# EAGLE design Stick IMUinator2368 (EAGLE 6.1)
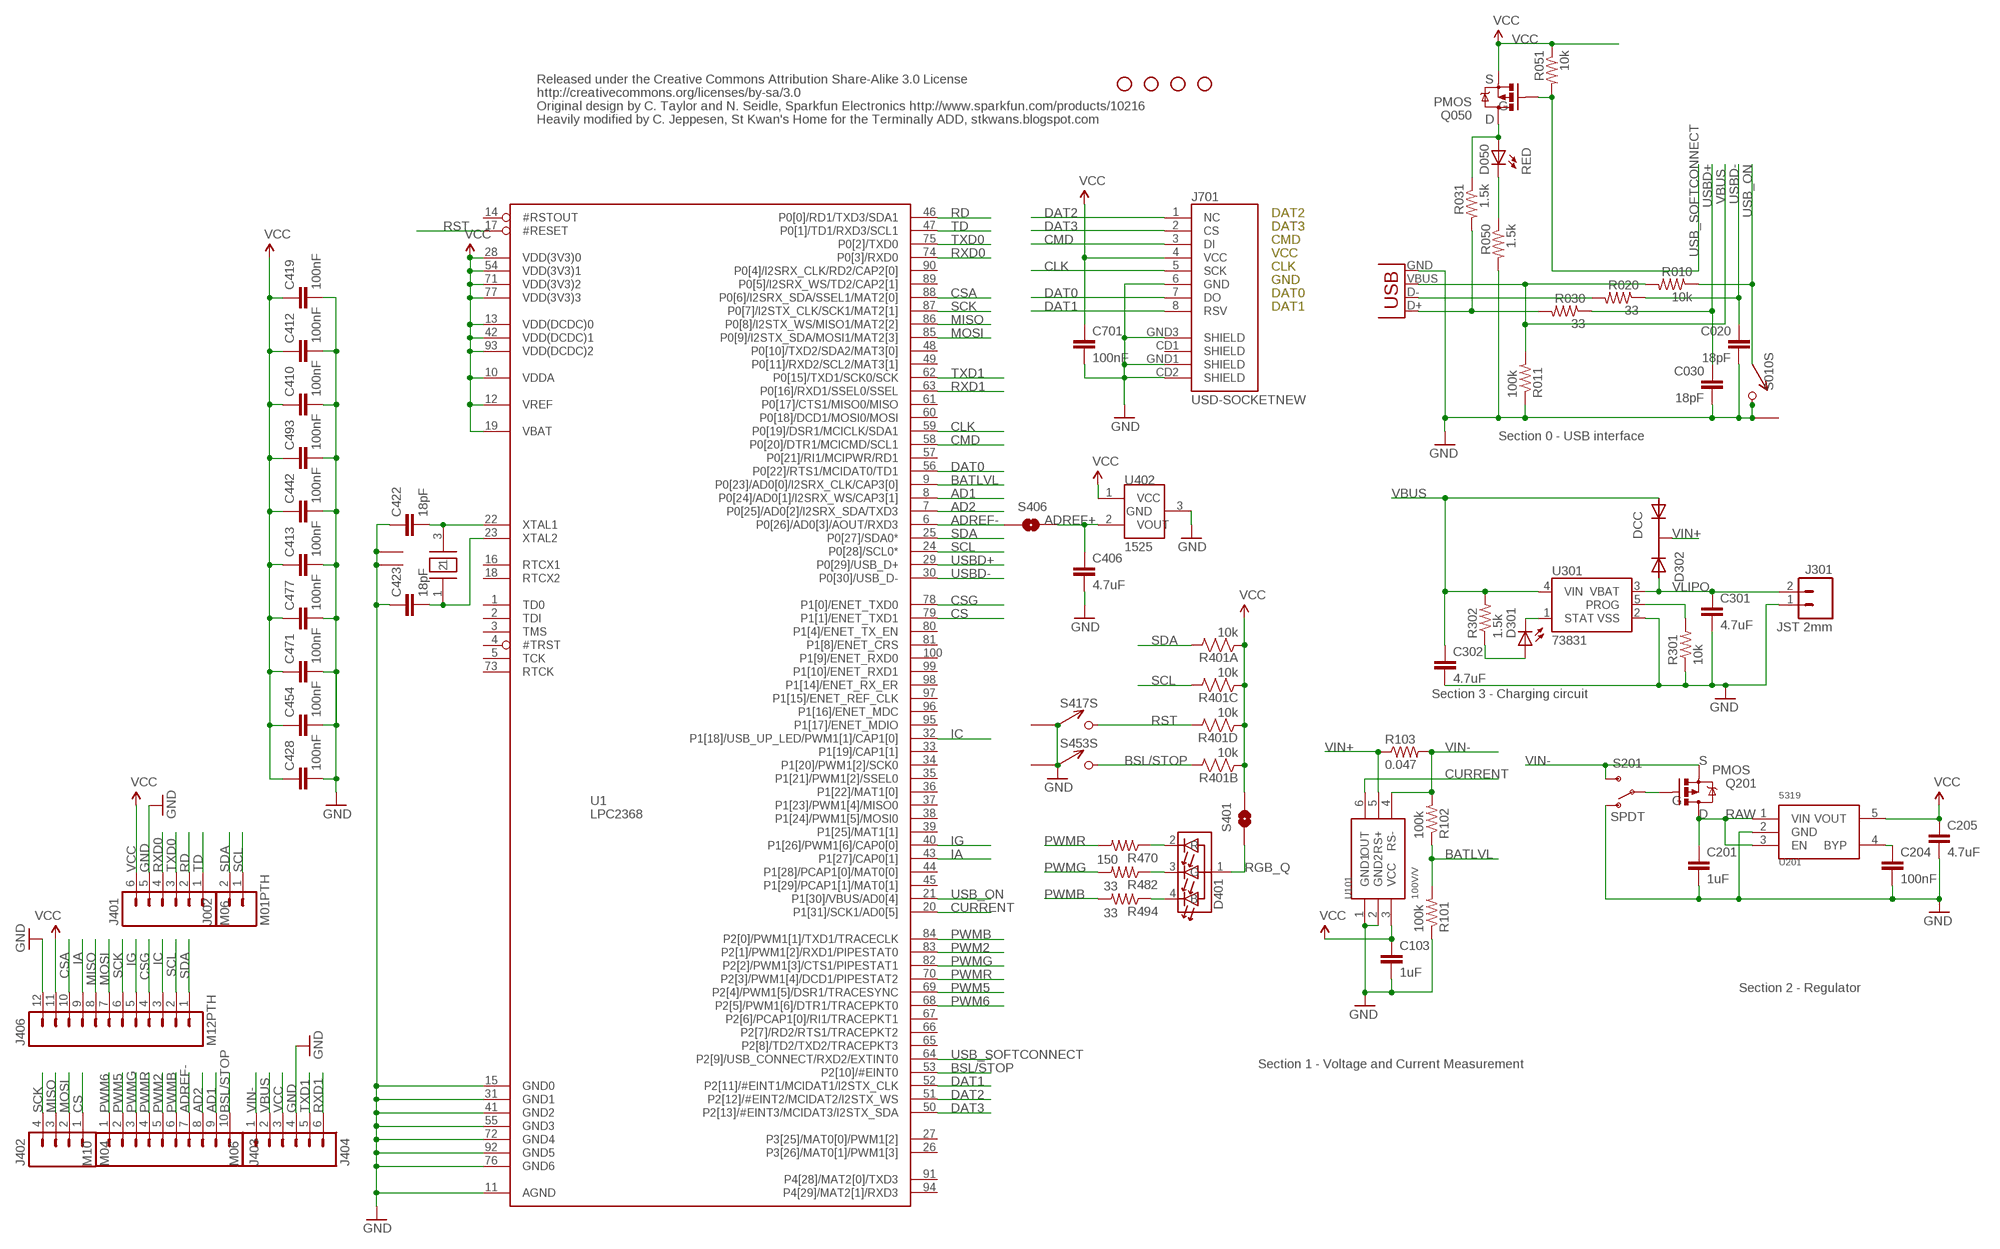
[diagram p0: schematic, sheet 1]

## Parts
C020  18pF  CAP0402-CAP  [0402-CAP]
C030  18pF  CAP0402-CAP  [0402-CAP]
C103  1uF  CAP0402-CAP  [0402-CAP]
C201  1uF  CAP0402-CAP  [0402-CAP]
C204  100nF  CAP0402-CAP  [0402-CAP]
C205  4.7uF  CAP0402-CAP  [0402-CAP]
C301  4.7uF  CAP0402-CAP  [0402-CAP]
C302  4.7uF  CAP0402-CAP  [0402-CAP]
C406  4.7uF  CAP0402-CAP  [0402-CAP]
C410  100nF  CAP0402-CAP  [0402-CAP]
C412  100nF  CAP0402-CAP  [0402-CAP]
C413  100nF  CAP0402-CAP  [0402-CAP]
C419  100nF  CAP0402-CAP  [0402-CAP]
C422  18pF  CAP0402-CAP  [0402-CAP]
C423  18pF  CAP0402-CAP  [0402-CAP]
C428  100nF  CAP0402-CAP  [0402-CAP]
C442  100nF  CAP0402-CAP  [0402-CAP]
C454  100nF  CAP0402-CAP  [0402-CAP]
C471  100nF  CAP0402-CAP  [0402-CAP]
C477  100nF  CAP0402-CAP  [0402-CAP]
C493  100nF  CAP0402-CAP  [0402-CAP]
C701  100nF  CAP0402-CAP  [0402-CAP]
D050  RED  LED0603  [LED-0603]
D301  RED  LED0603  [LED-0603]
D302  DCC  PMEG2005CT  [SOT-23-3]
D401  RGB  HSMF-C118  [HSMF-C118]
J001  USBSMD  [USB-MINIB]
J002  M01PTH  M02PTH  [1X02]
J301  JST 2mm  M02-JST-2MM-SMT  [JST-2-SMD]
J401  M06  M06SIP  [1X06]
J402  M04  M04PTH  [1X04]
J403  M10  M10"  [1X10]
J404  M06  M06SIP  [1X06]
J406  M12PTH  [1X12]
J701  USD-SOCKETNEW  [MICRO-SD-SOCKET-PP]
JP1  STAND-OFF  [STAND-OFF]
JP2  STAND-OFF  [STAND-OFF]
JP3  STAND-OFF  [STAND-OFF]
JP4  STAND-OFF  [STAND-OFF]
Q050  PMOS  MOSFET-PCHANNELSMD  [SOT23-3]
Q201  PMOS  MOSFET-PCHANNELSMD  [SOT23-3]
R010  10k  RESISTOR0402-RES  [0402-RES]
R011  100k  RESISTOR0402-RES  [0402-RES]
R020  33  RESISTOR0402-RES  [0402-RES]
R030  33  RESISTOR0402-RES  [0402-RES]
R031  1.5k  RESISTOR0402-RES  [0402-RES]
R050  1.5k  RESISTOR0402-RES  [0402-RES]
R051  10k  RESISTOR0402-RES  [0402-RES]
R101  100k  RESISTOR0402-RES  [0402-RES]
R102  100k  RESISTOR0402-RES  [0402-RES]
R103  0.047  RESISTOR0402-RES  [0402-RES]
R301  10k  RESISTOR0402-RES  [0402-RES]
R302  1.5k  RESISTOR0402-RES  [0402-RES]
R401  10k  RP404  [CRA04]
R470  150  RESISTOR0402-RES  [0402-RES]
R482  33  RESISTOR0402-RES  [0402-RES]
R494  33  RESISTOR0402-RES  [0402-RES]
S010  SPST  B3U-1100P  [B3U-1100P]
S201  SPDT  SWITCH-SPSTSMD  [AYZ0202]
S401  SOLDERJUMPERNO  [SJ_2S-NO]
S406  SOLDERJUMPERNO  [SJ_2S-NO]
S417  SPST  B3U-1100P  [B3U-1100P]
S453  SPST  B3U-1100P  [B3U-1100P]
U1  LPC2368  [LQFP100]
U101  100V/V  MAX4173  [SOT-23-6]
U201  5319  MIC5319D5  [SOT-23-5]
U301  73831  MCP73831  [SOT23-5]
U402  1525  MCP1525  [SOT-23-3]
Y401  12M  TSX-3225  [CRYSTAL_SMD]

## Nets
AD1: J403.9 U1.8(P0[24]/AD0[1]/I2SRX_WS/CAP3[1])
AD2: J403.8 U1.7(P0[25]/AD0[2]/I2SRX_SDA/TXD3)
ADREF+: C406.1 S406.1 U402.2(VOUT)
ADREF-: J403.7 S406.2 U1.6(P0[26]/AD0[3]/AOUT/RXD3)
BATLVL: R101.2 R102.1 U1.9(P0[23]/AD0[0]/I2SRX_CLK/CAP3[0])
BSL/STOP: J403.10 R401.7 S453.P$2 U1.53(P2[10]/#EINT0)
CLK: J701.5(SCK) U1.59(P0[19]/DSR1/MCICLK/SDA1)
CMD: J701.3(DI) U1.58(P0[20]/DTR1/MCICMD/SCL1)
CONN_D+: J001.D+ R030.2 R031.2
CONN_D-: J001.D- R020.2
CS: J402.1 U1.79(P1[1]/ENET_TXD1)
CSA: J406.10 U1.88(P0[6]/I2SRX_SDA/SSEL1/MAT2[0])
CSG: J406.4 U1.78(P1[0]/ENET_TXD0)
CURRENT: U1.20(P1[31]/SCK1/AD0[5]) U101.6(OUT)
DAT0: J701.7(DO) U1.56(P0[22]/RTS1/MCIDAT0/TD1)
DAT1: J701.8(RSV) U1.52(P2[11]/#EINT1/MCIDAT1/I2STX_CLK)
DAT2: J701.1(NC) U1.51(P2[12]/#EINT2/MCIDAT2/I2STX_WS)
DAT3: J701.2(CS) U1.50(P2[13]/#EINT3/MCIDAT3/I2STX_SDA)
DB: D401.4(B) R494.1
DG: D401.3(G) R482.1
DR: D401.2(R) R470.1
GND: C020.2 C030.2 C103.2 C201.2 C204.2 C205.2 C301.2 C302.2 C406.2 C410.2 C412.2 C413.2 C419.2 C422.1 C423.1 C428.2 C442.2 C454.2 C471.2 C477.2 C493.2 C701.2 J001.GND J301.1 J401.5 J404.4 J406.12 J701.6(GND) J701.CD2(SHIELD) J701.GND1(SHIELD) J701.GND3(SHIELD) R011.1 R050.2 R101.1 R301.1 S010.P$2 S010.P$3 S201.1(O) S417.P$1 S417.P$3 S453.P$1 S453.P$3 U1.11(AGND) U1.15(GND0) U1.31(GND1) U1.41(GND2) U1.55(GND3) U1.72(GND4) U1.76(GND6) U1.92(GND5) U101.1(GND1) U101.2(GND2) U201.2(GND) U301.2(VSS) U402.3(GND) Y401.2 Y401.4
IA: J406.9 U1.43(P1[27]/CAP0[1])
IC: J406.3 U1.32(P1[18]/USB_UP_LED/PWM1[1]/CAP1[0])
IG: J406.5 U1.40(P1[26]/PWM1[6]/CAP0[0])
MISO: J402.3 J406.8 U1.86(P0[8]/I2STX_WS/MISO1/MAT2[2])
MOSI: J402.2 J406.7 U1.85(P0[9]/I2STX_SDA/MOSI1/MAT2[3])
N$1: D301.A R302.1
N$2: R301.2 U301.5(PROG)
N$3: D301.C U301.1(STAT)
N$6: D050.A Q050.3(D) R031.1
N$7: D050.C R050.1
N$10: Q201.1(G) S201.2(P)
N$17: C204.1 U201.4(BYP)
PWM2: J403.5 U1.83(P2[1]/PWM1[2]/RXD1/PIPESTAT0)
PWM5: J403.2 U1.69(P2[4]/PWM1[5]/DSR1/TRACESYNC)
PWM6: J403.1 U1.68(P2[5]/PWM1[6]/DTR1/TRACEPKT0)
PWMB: J403.6 R494.2 U1.84(P2[0]/PWM1[1]/TXD1/TRACECLK)
PWMG: J403.3 R482.2 U1.82(P2[2]/PWM1[3]/CTS1/PIPESTAT1)
PWMR: J403.4 R470.2 U1.70(P2[3]/PWM1[4]/DCD1/PIPESTAT2)
RAW: C201.1 Q201.3(D) U201.1(VIN) U201.3(EN)
RD: J401.2 U1.46(P0[0]/RD1/TXD3/SDA1)
RGB_Q: D401.1(A) S401.1
RST: R401.5 S417.P$2 U1.17(#RESET)
RXD0: J401.4 U1.74(P0[3]/RXD0)
RXD1: J404.6 U1.63(P0[16]/RXD1/SSEL0/SSEL)
SCK: J402.4 J406.6 U1.87(P0[7]/I2STX_CLK/SCK1/MAT2[1])
SCL: J002.1 J406.2 R401.6 U1.24(P0[28]/SCL0*)
SDA: J002.2 J406.1 R401.8 U1.25(P0[27]/SDA0*)
TD: J401.1 U1.47(P0[1]/TD1/RXD3/SCL1)
TXD0: J401.3 U1.75(P0[2]/TXD0)
TXD1: J404.5 U1.62(P0[15]/TXD1/SCK0/SCK)
USB_ON: R010.1 S010.P$1 U1.21(P1[30]/VBUS/AD0[4])
USB_SOFTCONNECT: Q050.1(G) R051.2 U1.64(P2[9]/USB_CONNECT/RXD2/EXTINT0)
USBD+: C030.1 R030.1 U1.29(P0[29]/USB_D+)
USBD-: C020.1 R020.1 U1.30(P0[30]/USB_D-)
VBUS [power]: C302.1 D302.1(A1) J001.VBUS J404.2 R010.2 R011.2 R302.2 U301.4(VIN)
VCC: C103.1 C205.1 C410.1 C412.1 C413.1 C419.1 C428.1 C442.1 C454.1 C471.1 C477.1 C493.1 C701.1 J401.6 J404.3 J406.11 J701.4(VCC) Q050.2(S) R051.1 R401.1 R401.2 R401.3 R401.4 S401.2 U1.10(VDDA) U1.12(VREF) U1.13(VDD(DCDC)0) U1.19(VBAT) U1.28(VDD(3V3)0) U1.42(VDD(DCDC)1) U1.54(VDD(3V3)1) U1.71(VDD(3V3)2) U1.77(VDD(3V3)3) U1.93(VDD(DCDC)2) U101.3(VCC) U201.5(VOUT) U402.1(VCC)
VIN+: D302.3(K) R103.1 U101.5(RS+)
VIN-: J404.1 Q201.2(S) R102.2 R103.2 S201.3(S) U101.4(RS-)
VLIPO [power]: C301.1 D302.2(A2) J301.2 U301.3(VBAT)
XTAL1: C422.2 U1.22(XTAL1) Y401.3
XTAL2: C423.2 U1.23(XTAL2) Y401.1
Unconnected: J701.CD1(SHIELD) U1.1(TD0) U1.2(TDI) U1.3(TMS) U1.4(#TRST) U1.5(TCK) U1.14(#RSTOUT) U1.16(RTCX1) U1.18(RTCX2) U1.26(P3[26]/MAT0[1]/PWM1[3]) U1.27(P3[25]/MAT0[0]/PWM1[2]) U1.33(P1[19]/CAP1[1]) U1.34(P1[20]/PWM1[2]/SCK0) U1.35(P1[21]/PWM1[2]/SSEL0) U1.36(P1[22]/MAT1[0]) U1.37(P1[23]/PWM1[4]/MISO0) U1.38(P1[24]/PWM1[5]/MOSI0) U1.39(P1[25]/MAT1[1]) U1.44(P1[28]/PCAP1[0]/MAT0[0]) U1.45(P1[29]/PCAP1[1]/MAT0[1]) U1.48(P0[10]/TXD2/SDA2/MAT3[0]) U1.49(P0[11]/RXD2/SCL2/MAT3[1]) U1.57(P0[21]/RI1/MCIPWR/RD1) U1.60(P0[18]/DCD1/MOSI0/MOSI) U1.61(P0[17]/CTS1/MISO0/MISO) U1.65(P2[8]/TD2/TXD2/TRACEPKT3) U1.66(P2[7]/RD2/RTS1/TRACEPKT2) U1.67(P2[6]/PCAP1[0]/RI1/TRACEPKT1) U1.73(RTCK) U1.80(P1[4]/ENET_TX_EN) U1.81(P1[8]/ENET_CRS) U1.89(P0[5]/I2SRX_WS/TD2/CAP2[1]) U1.90(P0[4]/I2SRX_CLK/RD2/CAP2[0]) U1.91(P4[28]/MAT2[0]/TXD3) U1.94(P4[29]/MAT2[1]/RXD3) U1.95(P1[17]/ENET_MDIO) U1.96(P1[16]/ENET_MDC) U1.97(P1[15]/ENET_REF_CLK) U1.98(P1[14]/ENET_RX_ER) U1.99(P1[10]/ENET_RXD1) U1.100(P1[9]/ENET_RXD0)

## Notes on the sheet
- Released under the Creative Commons Attribution Share-Alike 3.0 License | S
- http://creativecommons.org/licenses/by-sa/3.0
- Original design by C. Taylor and N. Seidle, Sparkfun Electronics http://www.sparkfun.com/products/10216 | G
- Heavily modified by C. Jeppesen, St Kwan's Home for the Terminally ADD, stkwans.blogspot.com | D
- DAT2
- DAT3
- CMD
- VCC
- CLK
- GND
- DAT0
- DAT1
- Section 0 - USB interface
- Section 3 - Charging circuit
- S
- G
- D
- Section 2 - Regulator
- Section 1 - Voltage and Current Measurement

## Library data of the parts
C020 C030 C103 C201 C204 C205 C301 C302 C406 C410 C412 C413 C419 C422 C423 C428 C442 C454 C471 C477 C493 C701 = SparkFun:CAP: Capacitor Standard 0603 ceramic capacitor, and 0.1" leaded capacitor.
D050 D301 = SparkFun:LED: LEDs Standard schematic elements and footprints for 5mm, 3mm, 1206, and 0603 sized LEDs. 5mm - Spark Fun Electronics SKU : COM-00529 (and others)
D302 = KwanSystems:PMEG2005CT
D401 = KwanSystems:HSMF-C118
J001 = SparkFun:USB: USB Connectors USB-B-PTH is fully proven SKU : PRT-00139 USB-miniB is fully proven SKU : PRT-00587 USB-A-PCB is untested. USB-A-H is throughly reviewed, but untested. Spark Fun Electronics SKU : PRT-00437 USB-B-SMT is throughly reviewed, but untested. Needs silkscreen touching up. USB-A-S has not been used/tested USB-MB-H has not been used/tested
J002 J301 = SparkFun:M02: Header 2 Standard 2-pin 0.1" header. Use with straight break away headers (SKU : PRT-00116), right angle break away headers (PRT-00553), swiss pins (PRT-00743), machine pins (PRT-00117), and female headers (PRT-00115). Molex polarized connector foot print use with SKU : PRT-08233 with associated crimp pins and housings.
J401 J404 = SparkFun:M06: Header 6 Standard 6-pin 0.1" header. Use with straight break away headers (SKU : PRT-00116), right angle break away headers (PRT-00553), swiss pins (PRT-00743), machine pins (PRT-00117), and female headers (PRT-00115). Molex polarized connector foot print use with SKU : PRT-08094 with associated crimp pins and housings. NOTES ON THE VARIANTS LOCK and LOCK_LONGPADS... This footprint was designed to help hold the alignment of a through-hole component (i.e. 6-pin header) while soldering it into place. You may notice that each hole has been shifted either up or down by 0.005 of an inch from it's more standard position (which is a perfectly straight line). This slight alteration caused the pins (the squares in the middle) to touch the edges of the holes. Because they are alternating, it causes a "brace" to hold the component in place. 0.005 has proven to be the perfect amount of "off-center" position when using our standard breakaway headers. Although looks a little odd when you look at the bare footprint, once you have a header in there, the alteration is very hard to notice. Also, if you push a header all the way into place, it is covered up entirely on the bottom side. This idea of altering the position of holes to aid alignment will be further integrated into the Sparkfun Library for other footprints. It can help hold any component with 3 or more connection pins.
J402 = SparkFun:M04: Header 4 Standard 4-pin 0.1" header. Use with straight break away headers (SKU : PRT-00116), right angle break away headers (PRT-00553), swiss pins (PRT-00743), machine pins (PRT-00117), and female headers (PRT-00115). Molex polarized connector foot print use with SKU : PRT-08231 with associated crimp pins and housings. 1MM SMD Version SKU: PRT-10208
J403 = SparkFun:M10: Header 10 Standard 10-pin 0.1" header. Use with straight break away headers (SKU : PRT-00116), right angle break away headers (PRT-00553), swiss pins (PRT-00743), machine pins (PRT-00117), and female headers (PRT-00115).
J406 = SparkFun:M12: Header 12 Standard 12-pin 0.1" header. Use with straight break away headers (SKU : PRT-00116), right angle break away headers (PRT-00553), swiss pins (PRT-00743), machine pins (PRT-00117), and female headers (PRT-00115).
J701 = SparkFun:USD-SOCKET: microSD Socket Push-push type uSD socket. Schematic element and footprint production proven. Spark Fun Electronics SKU : PRT-00127. tDoc lines correctly indicate media card edge positions when inserting (unlocked, locked, depressed).
JP1-JP4 = SparkFun:STAND-OFF: Stand Off This is the mechanical footprint for a #4 phillips button head screw. Use the keepout ring to avoid running the screw head into surrounding components. SKU : PRT-00447
Q050 Q201 = SparkFun:MOSFET-PCHANNEL
R010 R011 R020 R030 R031 R050 R051 R101-R103 R301 R302 R470 R482 R494 = SparkFun:RESISTOR: Resistor Basic schematic elements and footprints for 0603, 1206, and PTH resistors.
R401 = KwanSystems:RP4
S010 S417 S453 = KwanSystems:B3U-1100P
S201 = SparkFun:SWITCH-SPST: SPST Switch Simple slide switch. Spark Fun Electronics SKU : COM-00102
S401 S406 = SparkFun:SOLDERJUMPER: Solder Jumper Standard SMD solder jumper. Used to automate production. Two varients : Normally Open and Normally Closed are the same, but have different paste layers. NC will have a large amount of paste and should jumper during reflow.
U1 = KwanSystems:LPC2368
U101 = KwanSystems:MAX4173
U201 = KwanSystems:MIC5319
U301 = SparkFun:MCP73831: Microchip's MCP73831 Miniature single cell, fully integrated Li-Ion, Li-polymer charge management controller http://ww1.microchip.com/downloads/en/DeviceDoc/21984a.pdf
U402 = KwanSystems:MCP1525
Y401 = KwanSystems:TSX-3225

## Net classes
0 default: width 0.152 mm, drill 0.33 mm, clearance 0.152 mm
1 power: width 0.152 mm, drill 0.33 mm, clearance 0.152 mm to class 0, clearance 0.152 mm
2 hv: width 0.152 mm, drill 0.33 mm, clearance 0.152 mm to class 0, clearance 0.152 mm to class 1, clearance 0.152 mm

## Board
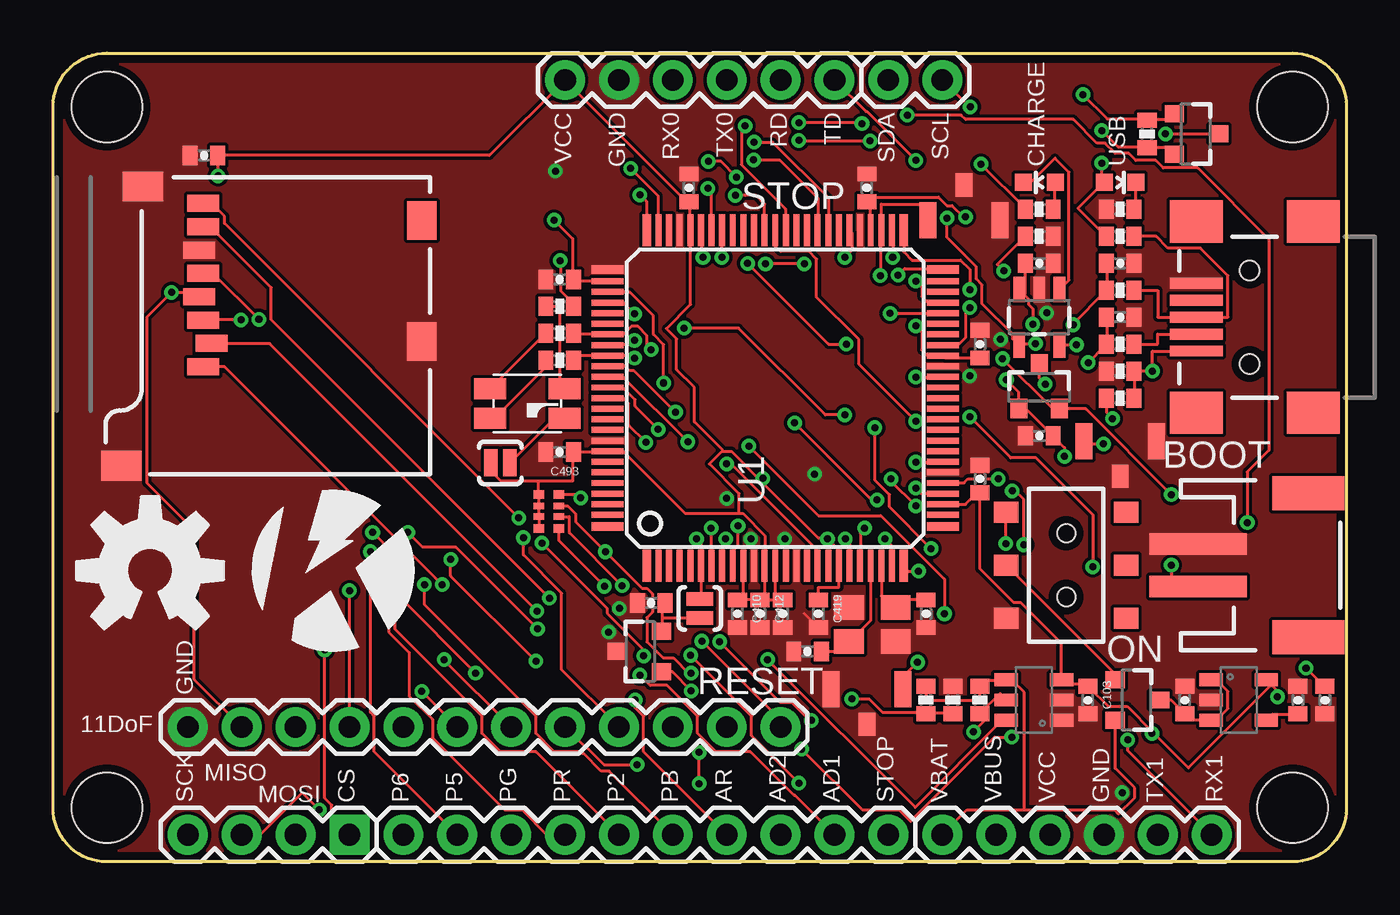
[diagram p1: board, top side]
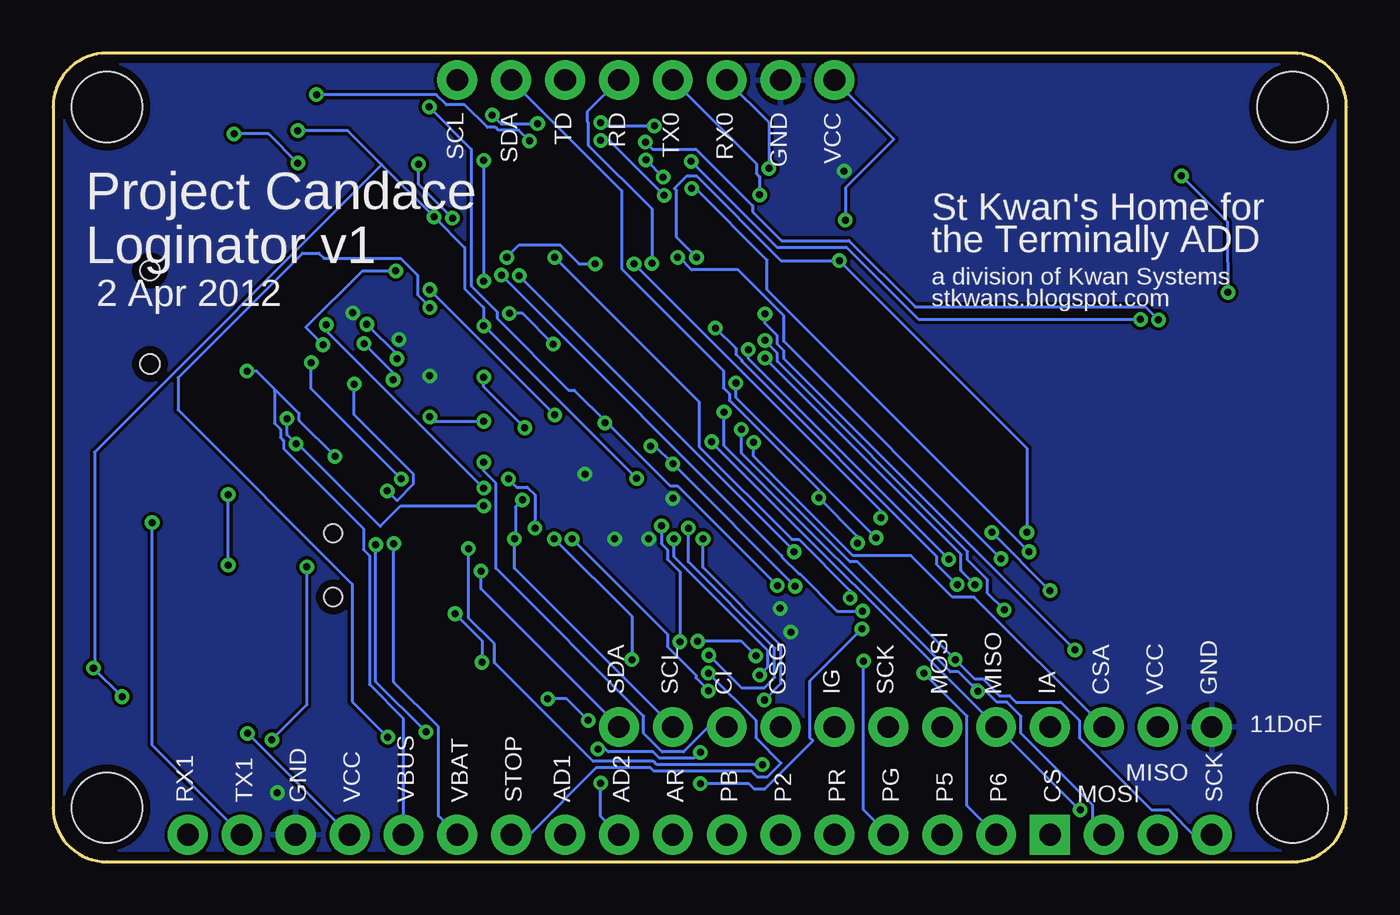
[diagram p2: board, bottom side, seen from below]

Size 60.96 x 38.1 mm. Coordinates in mm from the lower left corner, seen from the top.
Outline: 2.54,38.1 58.42,38.1 arc-90 60.96,35.56 60.96,2.54 arc-90 58.42,0 2.54,0 arc-90 0,2.54 0,35.56 arc-90 2.54,38.1
Copper layers (1*16): Top 0.0356mm / dielectric 1.5011mm / Bottom 0.0356mm
Design rules: minimum track width 6mil, minimum drill 13mil, track to track 6mil, track to pad 6mil, pad to pad 6mil, via to via 6mil, smd to smd 6mil, copper to edge 15mil, drill to drill 6mil, minimum pad ring 7mil, minimum via ring 7mil, stop-mask expansion 4mil, vias tented up to drill 14mil, thermal gap 10mil
vRestrict: area 5.8,2.3 to 6.6,5.1; area 7.1,3.8 to 10.4,4.6; area 9.4,2.8 to 13,3.6; area 13.2,2.8 to 14.5,4.8; area 15.7,2.8 to 17,4.8; area 18.3,2.8 to 19.6,4.8; area 20.8,2.8 to 22.1,4.8; area 23.4,2.8 to 24.6,4.8; area 25.9,2.8 to 27.2,4.8; area 28.4,2.8 to 29.7,4.8; area 31,2.8 to 32.3,4.8; area 33.5,2.8 to 34.8,4.8; 44 more areas

### Footprints (pad centres in the part's own frame; a part is rotated, then mirrored left to right if it is on the bottom)
0402-CAP = smd 0.7 x 0.9: 1 -0.65,0; 2 0.65,0
LED-0603 = smd 0.8 x 0.8: A 0,-0.75; C 0,0.75
SOT-23-3 = smd 0.9 x 0.8: 1 -1,0.95; 2 -1,-0.95; 3 1.1,0
HSMF-C118 = smd 1.5 x 1: 1 1.75,-0.7; 2 1.75,0.7; 3 -1.75,0.7; 4 -1.75,-0.7
USB-MINIB = smd 2.5 x 0.5: D+ 2.5,0; D- 2.5,0.8; GND 2.5,-1.6; ID 2.5,-0.8; VBUS 2.5,1.6 | smd 2.5 x 2: MTN1 -3,4.5; MTN2 2.5,4.5; MTN3 -3,-4.5; MTN4 2.5,-4.5 | hole 0.9: 0,2.2; 0,-2.2
1X02 = drill 1.016 pad 1.88: 1 0,0; 2 2.54,0
JST-2-SMD = smd 1 x 4.6: 1 -1,-3.7; 2 1,-3.7 | smd 1.6 x 3.4: NC1 -3.4,1.5; NC2 3.4,1.5
1X06 = drill 1.016 pad 1.88: 1 0,0; 2 2.54,0; 3 5.08,0; 4 7.62,0; 5 10.16,0; 6 12.7,0
1X04 = drill 1.016 pad 1.88 square: 1 0,0 | drill 1.016 pad 1.88: 2 2.54,0; 3 5.08,0; 4 7.62,0
1X10 = drill 1.016 pad 1.88: 1 0,0; 2 2.54,0; 3 5.08,0; 4 7.62,0; 5 10.16,0; 6 12.7,0; 7 15.24,0; 8 17.78,0; 9 20.32,0; 10 22.86,0
1X12 = drill 1.016 pad 1.88: 1 0,0; 2 2.54,0; 3 5.08,0; 4 7.62,0; 5 10.16,0; 6 12.7,0; 7 15.24,0; 8 17.78,0; 9 20.32,0; 10 22.86,0; 11 25.4,0; 12 27.94,0
MICRO-SD-SOCKET-PP = smd 0.8 x 1.5: 1 -8.94,10.7; 2 -7.84,10.3; 3 -6.74,10.7; 4 -5.64,10.9; 5 -4.54,10.7; 6 -3.44,10.9; 7 -2.34,10.7; 8 -1.24,10.7 | smd 1.8 x 1.4: CD1 -2.05,0.4; CD2 -7.75,0.4 | smd 1.4 x 1.9: GND1 -13.6,14.55; GND3 -0.45,13.55
STAND-OFF = hole 3.302: 0,0
SOT23-3 = smd 0.8 x 0.9: 1 -0.95,-1; 2 0.95,-1; 3 0,1.1
0402-RES = smd 0.7 x 0.9: 1 -0.65,0; 2 0.65,0
CRA04 = smd 0.4 x 0.5: 1 -0.8,-0.475; 4 0.8,-0.475; 5 0.8,0.475; 8 -0.8,0.475 | smd 0.3 x 0.5: 2 -0.25,-0.475; 3 0.25,-0.475; 6 0.25,0.475; 7 -0.25,0.475
B3U-1100P = smd 0.8 x 1.7: P$1 -1.7,0; P$2 1.7,0 | smd 0.8 x 1.1: P$3 0,-1.65
AYZ0202 = smd 1 x 1.15: 1 -2.5,2.825; 2 0,2.825; 3 2.5,2.825; 4 -2.5,-2.825; 5 0,-2.825; 6 2.5,-2.825 | hole 0.85: 1.5,0; -1.5,0
SJ_2S-NO = smd 0.635 x 1.27: 1 -0.45,0; 2 0.45,0
LQFP100 = smd 1.5 x 0.4: 1 -7.9,6.06; 25 -7.9,-6.06; 51 7.9,-6.06; 75 7.9,6.06 | smd 1.5 x 0.28: 2 -7.9,5.5; 3 -7.9,5; 4 -7.9,4.5; 5 -7.9,4; 6 -7.9,3.5; 7 -7.9,3; 8 -7.9,2.5; 9 -7.9,2; 10 -7.9,1.5; 11 -7.9,1; 12 -7.9,0.5; 13 -7.9,0; 14 -7.9,-0.5; 15 -7.9,-1; 16 -7.9,-1.5; 17 -7.9,-2; 18 -7.9,-2.5; 19 -7.9,-3; 20 -7.9,-3.5; 21 -7.9,-4; 22 -7.9,-4.5; 23 -7.9,-5; 24 -7.9,-5.5; 52 7.9,-5.5; 53 7.9,-5; 54 7.9,-4.5; 55 7.9,-4; 56 7.9,-3.5; 57 7.9,-3; 58 7.9,-2.5; 59 7.9,-2; 60 7.9,-1.5; 61 7.9,-1; 62 7.9,-0.5; 63 7.9,0; 64 7.9,0.5; 65 7.9,1; 66 7.9,1.5; 67 7.9,2; 68 7.9,2.5; 69 7.9,3; 70 7.9,3.5; 71 7.9,4; 72 7.9,4.5; 73 7.9,5; 74 7.9,5.5 | smd 0.4 x 1.5: 26 -6.06,-7.9; 50 6.06,-7.9; 76 6.06,7.9; 100 -6.06,7.9 | smd 0.28 x 1.5: 27 -5.5,-7.9; 28 -5,-7.9; 29 -4.5,-7.9; 30 -4,-7.9; 31 -3.5,-7.9; 32 -3,-7.9; 33 -2.5,-7.9; 34 -2,-7.9; 35 -1.5,-7.9; 36 -1,-7.9; 37 -0.5,-7.9; 38 0,-7.9; 39 0.5,-7.9; 40 1,-7.9; 41 1.5,-7.9; 42 2,-7.9; 43 2.5,-7.9; 44 3,-7.9; 45 3.5,-7.9; 46 4,-7.9; 47 4.5,-7.9; 48 5,-7.9; 49 5.5,-7.9; 77 5.5,7.9; 78 5,7.9; 79 4.5,7.9; 80 4,7.9; 81 3.5,7.9; 82 3,7.9; 83 2.5,7.9; 84 2,7.9; 85 1.5,7.9; 86 1,7.9; 87 0.5,7.9; 88 0,7.9; 89 -0.5,7.9; 90 -1,7.9; 91 -1.5,7.9; 92 -2,7.9; 93 -2.5,7.9; 94 -3,7.9; 95 -3.5,7.9; 96 -4,7.9; 97 -4.5,7.9; 98 -5,7.9; 99 -5.5,7.9
SOT-23-6 = smd 0.6 x 1.1: 1 -0.95,-1.3; 2 0,-1.3; 3 0.95,-1.3; 4 0.95,1.3; 5 0,1.3; 6 -0.95,1.3
SOT-23-5 = smd 0.6 x 1.1: 1 -0.95,-1.3; 2 0,-1.3; 3 0.95,-1.3; 4 0.95,1.3; 5 -0.95,1.3
SOT23-5 = smd 0.55 x 1.2: 1 -0.95,-1.3; 2 0,-1.3; 3 0.95,-1.3; 4 0.95,1.3; 5 -0.95,1.3
CRYSTAL_SMD = smd 1.4 x 1.15: 1 -1.1,-0.8; 2 1.1,-0.8; 3 1.1,0.8; 4 -1.1,0.8

### Placement (x,y rotation side)
C020  50.29,25.65 0 top
C030  50.29,28.19 0 top
C103  48.77,7.62 270 top
C201  53.34,7.62 90 top
C204  58.67,7.62 90 top
C205  59.94,7.62 270 top
C301  46.48,28.19 0 top
C302  46.48,20.07 180 top
C406  28.19,12.19 180 top
C410  32.26,11.68 270 top
C412  33.32,11.68 270 top
C413  34.39,11.68 270 top
C419  36.07,11.68 270 top
C422  35.56,9.91 0 top
C423  41.15,11.68 90 top
C428  43.69,18.03 90 top
C442  43.69,24.38 90 top
C454  38.35,31.75 90 top
C471  29.97,31.75 90 top
C477  23.88,27.43 180 top
C493  23.88,19.3 180 top
C701  7.11,33.27 180 top
D050  50.29,32 270 top
D301  46.48,32 90 top
D302  46.48,22.35 90 top
D401  22.35,21.59 0 top
J001  56.39,25.65 180 top
J002  41.91,36.83 180 top
J301  57.66,13.97 270 top
J401  36.83,36.83 180 top
J402  13.97,1.27 180 top
J403  16.51,1.27 0 top
J404  41.91,1.27 0 top
J406  34.29,6.35 180 top
J701  17.78,32.26 90 top
JP1  2.54,2.54 0 top
JP2  58.42,2.54 0 top
JP3  2.54,35.56 0 top
JP4  58.42,35.56 0 top
Q050  53.85,34.29 270 top
Q201  51.05,7.62 270 top
R010  50.29,21.84 0 top
R011  50.29,23.11 0 top
R020  50.29,24.38 0 top
R030  50.29,26.92 0 top
R031  50.29,29.46 0 top
R050  50.29,30.73 180 top
R051  51.56,34.29 90 top
R101  42.42,7.62 270 top
R102  41.15,7.62 90 top
R103  43.69,7.62 90 top
R301  46.48,29.46 180 top
R302  46.48,30.73 180 top
R401  23.37,16.51 270 top
R470  23.88,26.16 0 top
R482  23.88,24.89 0 top
R494  23.88,23.62 0 top
S010  50.29,19.81 0 top
S201  47.75,13.97 90 top
S401  21.08,18.8 180 top
S406  30.48,11.94 90 top
S417  38.35,8.13 0 top
S453  42.93,30.23 180 top
U1  34.04,21.84 90 top
U101  46.23,7.62 90 top
U201  55.88,7.62 270 top
U301  46.48,25.65 180 top
U402  27.69,9.91 180 top
U$1  [KWAN_CIRCLE]  13.21,13.72 0 top
U$2  [OSHW-LOGO-L]  4.57,13.72 0 top
Y401  38.61,11.18 180 top

### Tracks (layer width: path | path; a pad name or v marks a point on that pad's centre or on a via)
AD1  (via drill 0.33)
  Top 0.152: v31.7,15.21 31.55,15.06 U1.8 | v27.66,8.79 28.14,8.31 28.93,8.31 30.38,6.86 30.38,6.04 31.24,5.18 32.87,5.18 34.92,3.12 34.98,3.12 J403.9
  Bottom 0.152: v31.7,15.21 31.7,14.38 27.25,9.93 27.25,9.2 v27.66,8.79
AD2  (via drill 0.33)
  Top 0.152: v31.01,15.72 31.01,13.95 U1.7 | v30.05,9.73 32.92,6.86 32.92,5.94 v35.15,3.71
  Bottom 0.152: v31.01,15.72 31.01,14.12 26.95,10.06 26.95,8.69 27.43,8.2 28.52,8.2 v30.05,9.73 | v35.15,3.71 35.15,2.13 J403.8
ADREF+
  Top 0.152: 28.7,11.51 28.7,12.06 C406.1 | 28.7,11.51 28.7,10.87 U402.2 | 28.7,11.51 30.73,11.51 S406.1
ADREF-  (via drill 0.33)
  Top 0.152: 30.56,13.92 U1.6 | v30.33,15.21 30.53,15.01 30.53,14.02 U1.6 | v27.43,7.62 27.43,7.26 27.84,6.86 27.84,5.18 J403.7 | U1.6 30.54,12.59 S406.2
  Bottom 0.152: v30.33,15.21 30.33,13.87 26.64,10.19 26.64,8.41 v27.43,7.62
BATLVL  (via drill 0.33)
  Top 0.152: R101.2 42.42,6.99 41.15,6.99 R102.1 41.1,7.04 39.09,7.04 38.46,7.67 v37.64,7.67 | v35.74,6.66 35.66,6.66 34.8,7.52 34.27,7.52 v31.42,10.36 | v32.28,15.82 32.28,14.91 32.04,14.66 U1.9
  Bottom 0.152: v37.64,7.67 36.75,7.67 v35.74,6.66 | v31.42,10.36 31.42,13.66 32,14.25 32,14.71 32.28,14.99 v32.28,15.82
BSL/STOP  (via drill 0.33)
  Top 0.152: v38.99,27.61 38.99,29.72 39.01,29.74 U1.53 39.04,30.99 41.15,30.99 41.15,30.23 | R401.7 23.85,16.74 24.28,16.74 24.64,16.38 24.64,16 v26.04,14.61 27.76,12.88 27.99,12.88 28.25,12.62 28.25,11.76 27.99,11.51 27.99,10.36 28.75,9.6 29.23,9.6 29.95,8.89 v30.07,8.89 | 41.15,30.23 S453.P$2 | 41.15,30.23 40.89,30.23
  Bottom 0.152: v26.04,14.61 26.04,14.66 v38.99,27.61 | J403.10 38.51,1.27 35.36,4.42 32.79,4.42 32.64,4.27 28.04,4.27 27.76,3.99 27.3,3.99 26.64,4.65 27.84,5.84 27.84,6.66 v30.07,8.89
CLK  (via drill 0.33)
  Top 0.152: v9.7,25.55 7.54,27.71 J701.5 | v30.89,32.99 31.47,32.99 v32.21,32.26 | v33.02,33.07 34.24,33.07 36.04,31.27 36.04,29.77 36.07,29.74 | 36.07,29.72 36.07,29.74 | 36.07,29.74 U1.59
  Bottom 0.152: v9.7,25.55 20.17,25.55 23.57,28.96 26.85,28.96 v30.89,32.99 | v33.02,33.07 v32.21,32.26
CMD  (via drill 0.33)
  Top 0.152: v8.87,25.53 J701.3 | 36.52,29.77 U1.58 36.54,31.28 33.91,33.91 v33.05,33.91
  Bottom 0.152: v8.87,25.53 9.47,26.14 20.32,26.14 23.44,29.26 26.62,29.26 27.99,30.63 27.99,30.91 30.66,33.58 32.72,33.58 v33.05,33.91
CONN_D+
  Top 0.152: 53.87,25.65 J001.D+ | R031.2 51.99,29.46 52.55,28.91 54.08,28.91 55.37,27.61 55.37,25.65 J001.D+ | R030.2 52.07,26.92 52.07,25.65 J001.D+
CONN_D-
  Top 0.152: 53.87,24.87 J001.D- 52.07,24.85 52.07,24.38 R020.2
CS  (via drill 0.33)
  Top 0.152: v27.41,25.81 26.87,26.34 U1.79 | v12.8,9.98 12.8,3 13.13,2.67 13.13,2.11 J402.1
  Bottom 0.152: v27.41,25.81 27.41,25.38 26.82,24.79 26.82,24.38 26.52,24.08 26.52,23.7 v12.8,9.98
CSA  (via drill 0.33)
  Top 0.152: U1.88 26.87,21.84 27.13,21.59 27.13,20.57 v27.94,19.76
  Bottom 0.152: v27.94,19.76 27.94,19.1 23.27,14.43 20.52,14.43 18.57,12.47 17.55,12.47 J406.10
CSG  (via drill 0.33)
  Top 0.152: v28.78,22.55 28.78,24.36 28.3,24.84 28.3,25.73 27.2,26.82 26.14,26.82 U1.78 | v22.17,15.27 22.17,14.45 23.98,12.65 23.98,9.04 J406.4
  Bottom 0.152: v28.78,22.55 28.78,21.87 v22.17,15.27
CURRENT  (via drill 0.33)
  Top 0.152: v33.68,9.53 40.64,2.56 44.73,6.66 44.91,6.66 U101.6 | 37.52,13.95 U1.20 37.54,15.01 v37.34,15.21
  Bottom 0.152: v33.68,9.53 33.68,11.56 v37.34,15.21
DAT0  (via drill 0.33)
  Top 0.152: v23.39,12.42 10.29,25.53 10.29,27.05 7.37,29.97 7.11,29.97 7.08,29.94 J701.7 7.09,29.9 | v37.31,28.47 37.69,28.85 37.64,28.91 37.64,29.64 U1.56
  Bottom 0.152: v23.39,12.42 23.39,12.78 25.81,15.19 26.14,15.19 30.5,19.56 30.5,21.67 v37.31,28.47
DAT1  (via drill 0.33)
  Top 0.152: v21.95,16.2 8.08,30.07 8.08,30.4 7.47,31.01 J701.8 | v35.41,28.17 v33.58,28.17 | v39.57,28.47 39.57,29.72 U1.52
  Bottom 0.152: v21.95,16.2 21.95,16.54 v33.58,28.17 | v35.41,28.17 36.17,28.17 37.06,29.06 38.99,29.06 v39.57,28.47
DAT2  (via drill 0.33)
  Top 0.152: v18.34,13.06 8.08,23.32 J701.1 | v29.74,25.15 32.31,25.15 36.4,21.06 v37.31,21.06 | v43.2,26.95 43.2,27.91 42.77,28.35 40.49,28.35 40.1,28.74 U1.51
  Bottom 0.152: v18.34,13.06 18.36,13.06 19.33,14.02 19.33,14.4 28.5,23.57 28.5,23.62 28.78,23.9 28.78,24.18 v29.74,25.15 | v43.2,26.95 v37.31,21.06
DAT3  (via drill 0.33)
  Top 0.152: v22.81,11.81 10.21,24.41 7.49,24.41 J701.2 | 41.94,27.91 U1.50 41.91,27.93 41.91,27.94 40.13,27.94 v39.83,27.64
  Bottom 0.152: v22.81,11.81 24,11.81 25.76,13.56 25.81,13.56 26.62,14.38 26.62,14.43 v39.83,27.64
DB
  Top 0.152: R494.1 23.22,23.62 23.22,23.29 20.73,20.8 20.62,20.9 D401.4
DG
  Top 0.152: R482.1 23.22,24.89 20.62,22.3 D401.3
DR
  Top 0.152: 24.08,22.3 D401.2 24.1,22.32 24.13,22.35 23.88,22.35 23.88,26.16 R470.1
GND  (via drill 0.33)
  Top 0.152: 35.41,11.69 C419.2
  other vias: 44.65,24.61 43.21,22.89 46.84,25.86 50.39,3.25 26.19,10.82 26.7,11.94 32.89,15.21 31.75,17.12 23.67,32.54 34.49,15.21 35.89,18.26
  pour Bottom: 2.54,38.1 58.42,38.1 arc-90 60.96,35.56 60.96,2.54 arc-90 58.42,0 2.54,0 arc-90 0,2.54 0,35.56 arc-90
  pour Top (no thermals): 2.54,38.1 58.42,38.1 arc-90 60.96,35.56 60.96,2.54 arc-90 58.42,0 2.54,0 arc-90 0,2.54 0,35.56 arc-90
IA  (via drill 0.33)
  Top 0.152: v43.2,26.11 43,25.91 43,24.69 42.67,24.36 41.96,24.36 U1.43 | v45.19,5.87 44.37,5.87 40.41,1.91 39.88,2.44 38.15,2.44 v35.28,5.31 | v30.45,3.68 v30.45,5.16 | v22.84,10.97 18.97,14.83 17.4,14.83 v16.71,15.52 | J406.9 v13.97,12.78
  Bottom 0.152: v43.2,26.11 43.2,26.14 43.79,26.72 43.79,27.64 44.58,28.42 48.18,28.42 48.44,28.68 49.2,28.68 55.07,22.81 55.07,21.29 46.86,13.08 46.86,7.54 v45.19,5.87 | v35.28,5.31 34.92,5.31 34.8,5.18 32.69,5.18 32.38,4.88 30.73,4.88 v30.45,5.16 | v30.45,3.68 28.17,3.68 27.89,3.4 27.43,3.4 25.15,5.69 25.3,5.84 25.3,8.51 v22.84,10.97 | v13.97,12.78 v16.71,15.52
IC  (via drill 0.33)
  Top 0.152: v40.66,18.82 41.94,18.82 U1.32
  Bottom 0.152: v40.66,18.82 40.66,18.41 40.08,17.83 40.08,13.82 33.12,6.86 33.12,6.04 32.26,5.18 31.24,5.18 29.64,6.78 J406.3
IG  (via drill 0.33)
  Top 0.152: v40.66,22.84 U1.40 | v38.73,20.45 38.73,17.98 39.42,17.3 39.42,16.71 v41.38,14.76 | v27.53,4.57 25.96,4.57 25.12,5.41 25.07,5.41 J406.5
  Bottom 0.152: v40.66,22.84 40.66,22.38 v38.73,20.45 | v41.38,14.76 41.38,11.48 40.16,10.26 40.16,9.37 35.51,4.72 32.66,4.72 32.51,4.57 v27.53,4.57
MISO  (via drill 0.33)
  Top 0.152: v29.92,19.79 26.87,22.84 U1.86 | J402.3 9.75,1.27 11.73,3.25 v12.55,2.44
  Bottom 0.152: v29.92,19.79 29.92,19.76 J406.8 12.6,2.44 v12.55,2.44
MOSI  (via drill 0.33)
  Top 0.152: v29.34,21.18 27.38,23.14 27.18,23.14 26.98,23.34 U1.85 | v17.37,8.03 J406.7
  Bottom 0.152: v29.34,21.18 29.34,19.61 18.67,8.94 18.29,8.94 17.65,8.31 17.27,8.31 17.18,8.22 | 17.18,8.22 16.48,7.52 16,7.52 15.34,6.86 15.34,6.04 11.96,2.67 11.96,1.8 J402.2 | 17.18,8.22 v17.37,8.03
N$1
  Top 0.152: D301.A 47.22,30.81 47.14,30.73 R302.1
N$2  (via drill 0.33)
  Top 0.152: v44.81,27.84 44.5,28.14 R301.2 | v48.23,24.36 47.45,24.36 U301.5
  Bottom 0.152: v44.81,27.84 46.38,27.84 49.05,25.17 v48.23,24.36
N$3
  Top 0.152: D301.C 46.08,32 47.22,33.15 47.88,32.49 47.88,27.41 47.45,26.98 U301.1
N$6  (via drill 0.33)
  Top 0.152: R031.1 48.31,30.79 D050.A 49.48,32.05 49.43,32.11 v49.43,32.92 | v52.43,34.29 Q050.3
  Bottom 0.152: v52.43,34.29 50.8,34.29 v49.43,32.92
N$7
  Top 0.152: D050.C 51.03,30.81 50.95,30.73 R050.1
N$10
  Top 0.152: Q201.1 50.04,8.59 50.04,8.87 S201.2
N$17
  Top 0.152: C204.1 57.48,6.96 57.2,6.68 U201.4
PWM2  (via drill 0.33)
  Top 0.152: v27.41,24.56 27.2,24.36 26.14,24.36 U1.83 | v16.13,11.86 16.13,10.95 20.22,6.86 20.22,6.04 21.08,5.18 22.76,5.18 J403.5
  Bottom 0.152: v27.41,24.56 27.41,24.54 26.82,23.95 26.82,23.57 17.86,14.61 17.86,14.22 16.92,13.28 16.92,12.65 v16.13,11.86
PWM5  (via drill 0.33)
  Top 0.152: v30.86,31.73 31.01,31.57 31.01,29.77 U1.69 | v14.96,14.61 14.96,7.04 15.14,6.86 15.14,5.18 J403.2
  Bottom 0.152: v30.86,31.73 30.68,31.73 27.3,28.35 27.3,26.95 v14.96,14.61
PWM6  (via drill 0.33)
  Top 0.152: v31.52,28.47 31.52,29.74 U1.68 | v16.28,14.28 16.28,12.52 v19.91,8.89
  Bottom 0.152: v31.52,28.47 31.45,28.47 30.86,27.89 28.68,27.89 26.52,25.73 26.52,24.51 v16.28,14.28 | v19.91,8.89 17.88,6.86 17.88,2.64 J403.1
PWMB  (via drill 0.33)
  Top 0.152: v27.41,23.72 27.28,23.85 26.21,23.85 U1.84 26.11,23.85 24.74,23.85 24.51,23.62 24.54,23.6 R494.2 | v17.5,13.06 17.5,12.12 22.76,6.86 22.76,6.04 23.62,5.18 24.87,5.18 24.94,5.11 24.99,5.11 25.83,4.27 26.21,4.27 J403.6
  Bottom 0.152: v27.41,23.72 18.16,14.48 18.16,13.72 v17.5,13.06
PWMG  (via drill 0.33)
  Top 0.152: v28.19,24.13 27.99,24.33 27.99,24.79 27.56,25.22 27.25,25.22 26.88,24.84 U1.82 24.64,24.84 | v18.75,14.25 18.75,13.46 v22.76,9.45 | 24.64,24.84 24.64,24.89 | 24.64,24.84 24.53,24.84 R482.2
  Bottom 0.152: v28.19,24.13 28.19,23.7 v18.75,14.25 | v22.76,9.45 22.76,2.44 J403.3
PWMR  (via drill 0.33)
  Top 0.152: v23.9,28.32 23.93,28.3 23.93,26.9 24.51,26.31 24.51,26.16 R470.2 | U1.70 30.56,29.74 30.56,28.55 v30.63,28.47 | J403.4 23.27,1.27 22.1,2.44 21.29,2.44 17.88,5.84 17.88,6.71 16.79,7.8 16.79,9.86 15.82,10.82 15.82,11.35 15.54,11.63 15.54,15.04 v15.06,15.52
  Bottom 0.152: v30.63,28.47 31.57,29.41 31.57,31.62 31.67,31.73 31.09,32.31 30.63,32.31 26.64,28.32 v23.9,28.32 15.06,19.48 v15.06,15.52
RAW
  Top 0.152: Q201.3 52.7,7.62 53.34,6.99 C201.1 53.39,6.93 53.65,6.68 54.56,6.68 U201.3 54.63,6.68 54.74,6.58 55.37,7.21 55.37,8.03 54.84,8.56 U201.1
RD  (via drill 0.33)
  Top 0.152: v39.45,25.83 U1.46 | v37.39,24.38 36.55,24.38 v32.74,28.19
  Bottom 0.152: v39.45,25.83 38.84,25.83 v37.39,24.38 | v32.74,28.19 32.74,30.76 35.74,33.76 35.74,34.82 35.79,34.87 35.79,35.33 J401.2
RGB_Q
  Top 0.152: S401.1 23.85,21.11 24.08,20.88 D401.1
RST  (via drill 0.33)
  Top 0.152: v25.98,12.98 23.85,15.11 23.85,15.7 R401.5 | v31.75,18.75 31.95,18.75 36.02,14.68 36.02,13.95 U1.17 | v40.74,9.4 40.06,8.71 S417.P$2 | v42.01,11.68 42.01,13.31 39.01,16.31 36.07,16.31 v32.79,19.58
  Bottom 0.152: v25.98,12.98 v31.75,18.75 32.59,19.58 v32.79,19.58 | v40.74,9.4 40.74,10.41 v42.01,11.68
RXD0  (via drill 0.33)
  Top 0.152: v27.23,32.66 28.52,31.37 28.52,29.77 U1.74
  Bottom 0.152: v27.23,32.66 27.23,34.85 J401.4
RXD1  (via drill 0.33)
  Top 0.152: U1.63 34.04,29.01 34.29,28.75 35.64,28.75 35.99,28.4 35.99,26.59 37.97,24.61 37.97,23.44 v40.66,20.75 | v50.65,5.74 50.65,5.23 J404.6 | v43.2,20.95 45.14,19.02 46.33,19.02 49,16.36 v49,13.89
  Bottom 0.152: v40.66,20.75 43,20.75 v43.2,20.95 | v50.65,5.74 49,7.39 v49,13.89
SCK  (via drill 0.33)
  Top 0.152: v28.52,20.37 27.43,21.46 27.43,21.77 26.87,22.33 26.14,22.33 U1.87 | v18.44,9.53 18.44,9.5 J406.6
  Bottom 0.152: v28.52,20.37 28.52,19.25 23.39,14.12 23.04,14.12 v18.44,9.53 17.53,8.61 17.14,8.61 16.36,7.82 15.88,7.82 15.57,7.52 13.46,7.52 12.6,6.66 12.6,5.84 9.2,2.44 8.38,2.44 7.21,1.27 J402.4
SCL  (via drill 0.33)
  Top 0.152: v39.22,15.21 39.52,14.91 39.52,13.95 U1.24 | v26.82,13.01 24.33,15.49 24.33,16.26 R401.6 | v43.23,35.56 43.18,35.56 J002.1 | v38.84,17.04 38.58,17.04 v34.95,20.68
  Bottom 0.152: J406.2 39.22,13.82 v39.22,15.21 39.17,15.27 39.17,16.71 v38.84,17.04 | v26.82,13.01 31.52,17.7 31.88,17.7 34.9,20.73 | 34.9,20.73 36.4,22.23 36.65,22.23 40.03,25.6 40.03,25.91 41.25,27.13 41.25,33.58 v43.23,35.56 | v34.95,20.68 34.9,20.73
SDA  (via drill 0.33)
  Top 0.152: v24.87,17.14 24.71,17.3 23.85,17.3 R401.8 | J406.1 34.29,6.68 v30.58,10.39 | v27.84,9.7 27.84,9.98 26.11,11.71 26.11,11.94 v23.04,15.01 | U1.25 40.1,13.69 v40.79,13.69
  Bottom 0.152: v40.79,13.69 40.79,12.85 J406.1 | J002.2 34.16,31.62 34.16,27.94 29.36,23.14 29.36,22.33 29.08,22.05 29.08,21.74 24.87,17.53 v24.87,17.14 23.04,15.32 v23.04,15.01 | v30.58,10.39 28.52,10.39 v27.84,9.7
TD  (via drill 0.33)
  Top 0.152: v40.66,27.36 40.95,27.08 40.95,26.62 41.2,26.36 41.94,26.36 U1.47 | v40.66,33.05 38.35,35.36 38.3,35.36 J401.1
  Bottom 0.152: v40.66,33.05 v40.66,27.36
TXD0  (via drill 0.33)
  Top 0.152: v27.66,31.42 27.96,31.11 27.96,29.77 U1.75
  Bottom 0.152: v27.66,31.42 27.66,32.28 27.81,32.44 27.81,32.89 J401.3
TXD1  (via drill 0.33)
  Top 0.152: v32.61,34.67 32.44,34.49 32.44,32.84 34.52,30.76 34.52,29.77 U1.62 | v35.15,34.82 38.08,34.82 v38.12,34.77 | v40.26,35.18 42.8,35.18 43,34.98 48.08,34.98 49.2,33.86 49.58,33.86 50.06,33.38 50.7,33.38 51.03,33.05 51.97,33.05 52.32,32.69 53.95,32.69 57.3,29.34 57.3,19.38 56.29,18.36 v56.29,15.98
  Bottom 0.152: v32.61,34.67 35,34.67 v35.15,34.82 | v38.12,34.77 39.85,34.77 v40.26,35.18 | v56.29,15.98 56.29,5.49 J404.5
USB_ON  (via drill 0.33)
  Top 0.152: v49.94,20.88 49.66,21.16 49.66,21.84 R010.1 | v49.51,19.68 48.74,19.68 48.62,19.81 S010.P$1 | v39.5,18.03 39.5,17.93 v40.66,16.76 | U1.21 38.05,15.52 v38.25,15.72
  Bottom 0.152: v49.94,20.88 49.94,20.12 v49.51,19.68 49.45,19.71 45.54,15.8 44.58,16.76 v40.66,16.76 | v38.25,15.72 38.25,17.3 38.61,17.65 39.12,17.65 v39.5,18.03
USB_SOFTCONNECT  (via drill 0.33)
  Top 0.152: Q050.1 52.83,35.23 52.55,34.95 R051.2 51.51,35 49.68,35 v48.54,36.14 | v38.51,33.96 35.18,33.96 v35.15,33.98 | 32.61,31.39 v32.16,31.39 33.12,31.39 33.54,30.98 U1.64
  Bottom 0.152: v48.54,36.14 42.9,36.14 42.42,35.66 41.55,35.66 40.49,34.59 40.11,34.59 39.98,34.47 39.01,34.47 v38.51,33.96 | v35.15,33.98 34.75,33.98 v32.16,31.39
USBD+  (via drill 0.33)
  Top 0.152: C030.1 49.66,28.19 49.66,26.92 R030.1 49.61,26.87 48.06,25.32 v48.08,25.3 | U1.29 40.92,17.34 v40.66,17.6
  Bottom 0.152: v48.08,25.3 48.08,25.02 v40.66,17.6
USBD-  (via drill 0.33)
  Top 0.152: C020.1 49.66,25.65 49.66,24.38 R020.1 49.61,24.33 v48.79,23.52 | U1.30 42.94,17.84 43.13,18.03 v44.55,18.03
  Bottom 0.152: v48.79,23.52 48.79,22.28 v44.55,18.03
VBUS  (via drill 0.33)
  Top 0.152: R010.2 50.95,21.84 50.95,23.11 R011.2 51,23.16 51.05,23.16 51.05,23.11 v51.82,23.11 51.82,24.05 J001.VBUS 53.9,24.13 53.89,24.13 | 53.87,24.05 J001.VBUS 53.89,24.13 | v43.74,32.87 45.82,30.79 R302.2 | v42.14,30.33 42.14,29.41 43.51,28.04 43.51,27.46 43.79,27.18 43.79,26.29 45.24,24.84 45.24,24.64 45.52,24.36 U301.4 45.57,24.41 v46.3,24.41 | v44.93,22.71 45.49,22.15 45.49,21.41 D302.1 45.54,21.34 45.85,21.34 47.12,20.07 C302.1 47.17,20.02 47.68,19.51 v47.68,19.1 | 53.89,24.13 53.85,24.13
  Bottom 0.152: v43.74,32.87 43.74,31.93 v42.14,30.33 | v44.93,22.71 44.93,23.04 v46.3,24.41 | v51.82,23.11 51.36,23.11 50.47,22.23 | 50.47,22.23 49.35,21.11 49.35,20.78 v47.68,19.1 | J404.2 44.45,6.76 46.05,8.36 46.05,14.43 46.33,14.71 46.33,15.7 50.09,19.46 50.09,19.84 50.24,19.99 50.24,20.37 50.52,20.65 50.52,22.17 50.47,22.23
VCC  (via drill 0.33)
  Top 0.152: J406.11 6.66,8.59 6.66,15.62 4.42,17.86 4.42,25.65 v5.59,26.82 6.71,26.82 6.86,26.67 6.86,26.64 J701.4 | U1.77 26.11,27.36 24.64,27.36 24.64,27.43 C477.1 24.49,27.48 24.49,29.36 v23.62,30.23 | 7.77,33.27 20.57,33.27 J401.6 29.82,31.14 29.92,31.14 C471.1 29.97,30.99 30.02,30.94 30.02,29.77 U1.71 30.05,29.67 30.05,26.26 28.91,25.12 29.39,24.64 29.39,23.19 30.23,22.35 30.23,20.73 31.57,19.38 31.57,19.33 | 7.77,33.27 C701.1 | v59.05,9.12 59.89,8.28 C205.1 | v57.71,7.77 57.71,8.05 57.2,8.56 U201.5 57.38,8.28 53.52,4.42 51.84,6.1 | U1.28 41.96,16.84 43,16.84 43.43,17.27 43.69,17.27 | 51.84,6.1 50.62,7.32 49.73,7.32 48.82,8.23 C103.1 48.77,8.38 47.55,8.38 47.55,8.56 U101.3 47.5,8.64 47.5,10.31 45.59,12.22 45.26,12.22 43.69,13.79 43.69,17.27 | v51.79,6.04 51.84,6.1 | C442.1 43.69,23.75 42.04,23.75 41.96,23.82 U1.42 41.86,23.85 41.2,23.85 40.95,24.11 40.95,24.97 v40.66,25.25 | Q050.2 52.83,33.35 52.55,33.63 R051.1 51.51,33.68 50.19,33.68 v49.43,34.44 | v43,30.38 42.9,30.38 42.37,30.91 42.14,30.91 41.73,31.32 38.61,31.32 | 38.61,31.32 38.06,31.32 arc90 C454.1 | v30.07,8.05 29.18,8.94 28.7,8.94 U402.1 | U1.19 | 33.55,13.95 U1.12 | U1.13 34.04,12.34 | C412.1 33.53,12.34 32.26,12.34 C410.1 32.54,12.39 32.54,13.92 U1.10 | 34.04,12.34 33.58,12.34 C412.1 | 34.04,12.34 C413.1 | 36.07,12.34 C419.1 36.07,12.93 37.03,12.93 U1.19 | U1.12 33.55,13.87 33.55,12.45 33.58,12.42 C412.1 | R401.4 22.91,15.72 22.91,16.26 R401.3 22.91,16.33 22.91,16.74 R401.2 22.91,16.82 22.91,17.3 R401.1 22.89,17.27 22.86,17.27 22.86,17.93 | 24.49,19.25 24.64,19.1 | 24.49,19.25 C493.1 26.09,19.3 26.11,19.33 U1.93 26.21,19.36 26.85,19.36 29.79,16.41 32.33,16.41
  Top 0.152: 22.86,17.93 21.11,17.93 20.65,18.39 20.65,18.8 S401.2 | 32.33,16.41 32.51,16.41 33.55,15.37 33.55,14.02 U1.12 | 33.35,17.96 31.98,19.33 31.57,19.33 | 33.35,17.96 36.04,15.27 36.45,15.27 v36.5,15.21 37.03,14.68 U1.19 | 31.57,19.33 31.52,19.33 30.94,18.75 32.33,17.35 32.33,16.41 | v33.45,18.06 33.35,17.96 | v7.77,32.31 7.77,33.27 | C428.1 43.69,17.27 | 24.49,19.25 24.49,17.93 22.86,17.93 | U1.54 38.54,31.25 arc-90 38.61,31.32
  Bottom 0.152: v23.62,30.23 23.62,31.75 21.34,34.04 J401.6 | v5.59,26.82 5.61,29.64 5.61,30.15 v7.77,32.31 | v57.71,7.77 v59.05,9.12 59,9.17 59,19.3 45.47,32.84 | J404.3 47.02,1.27 v51.79,6.04 | v49.43,34.44 47.07,34.44 45.47,32.84 | 45.47,32.84 v43,30.38 41.55,28.93 41.55,27 40.66,26.11 v40.66,25.25 40.62,25.2 40.59,25.2 v33.45,18.06 | v30.07,8.05 30.07,8.08 30.66,8.66 30.66,8.79 32,10.13 32,10.72 v36.5,15.21
VIN+  (via drill 0.33)
  Top 0.152: U101.5 44.63,7.92 43.69,6.99 R103.1 43.66,6.91 43.92,6.66 v43.38,6.12 | D302.3 46.48,22.78 v46.76,22.5 | v45.21,17.48 45.34,17.48 45.74,17.07 v45.74,14.94
  Bottom 0.152: v46.76,22.5 46.76,21.06 43.97,18.26 43.97,17.8 44.76,17.02 v45.21,17.48 | v45.74,14.94 45.74,8.48 v43.38,6.12
VIN-  (via drill 0.33)
  Top 0.152: 45.77,2.44 43.08,2.44 J404.1 | 45.77,2.44 50.04,2.44 50.22,2.26 50.98,3.02 50.98,3.48 50.06,4.39 50.06,6.66 Q201.2 | v44.91,14.99 44.91,16.46 S201.3 | 45.77,2.44 45.77,7.98 45.21,8.53 44.98,8.53 U101.4 44.91,8.56 43.99,8.56 43.74,8.31 R103.2 43.69,7.62 41.15,7.62 R102.2
  Bottom 0.152: v44.91,14.99 44.91,8.46 42.8,6.35 42.8,2.16 J404.1
VLIPO  (via drill 0.33)
  Top 0.152: v44.76,23.7 47.09,21.36 47.42,21.36 D302.2 47.5,21.34 48.67,21.34 v52.7,17.3 | v46.18,25.32 46.18,26.06 45.97,26.26 45.97,26.52 45.77,26.72 | 45.77,26.72 45.54,26.95 U301.3 | C301.1 45.82,26.77 45.77,26.72 | J301.2 53.96,12.95 52.7,12.95 v52.7,13.97
  Bottom 0.152: v44.76,23.7 44.76,23.9 v46.18,25.32 | v52.7,13.97 v52.7,17.3
XTAL1
  Top 0.152: U1.22 38.54,11.36 37.55,10.38 Y401.3 37.04,9.91 C422.2
XTAL2
  Top 0.152: U1.23 39.04,12.53 39.37,12.19 39.49,12.19 Y401.1 40.07,12.33 C423.2

### Text on the board
tPlace: VCC | GND | RX0 | TX0 | RD | TD | SDA | SCL | CHARGE | USB | STOP | BOOT | ON | RESET | GND | 11DoF | MISO | SCK | MOSI | CS | P6 | P5 | PG | PR | P2 | PB | AR | AD2 | AD1 | STOP | VBAT | VBUS | VCC | GND | TX1 | RX1
bPlace: VCC | GND | RX0 | TX0 | RD | TD | SDA | SCL | Project Candace | St Kwan's Home for | the Terminally ADD | Loginator v1 | a division of Kwan Systems | stkwans.blogspot.com | 2 Apr 2012 | GND | VCC | CSA | IA | MISO | MOSI | SCK | IG | CSG | CI | SCL | SDA | 11DoF | MISO | SCK | MOSI | CS | P6 | P5 | PG | PR | P2 | PB | AR | AD2 | AD1 | STOP | VBAT | VBUS | VCC | GND | TX1 | RX1
Document: Released under the Creative Commons Attribution Share-Alike 3.0 License | http://creativecommons.org/licenses/by-sa/3.0 | Original design by C. Taylor and N. Seidle, Sparkfun Electronics http://www.sparkfun.com/products/10216 | Heavily modified by C. Jeppesen, St Kwan's Home for the Terminally ADD, stkwans.blogspot.com